# EAGLE schematic Player Module (EAGLE 9.3.0)
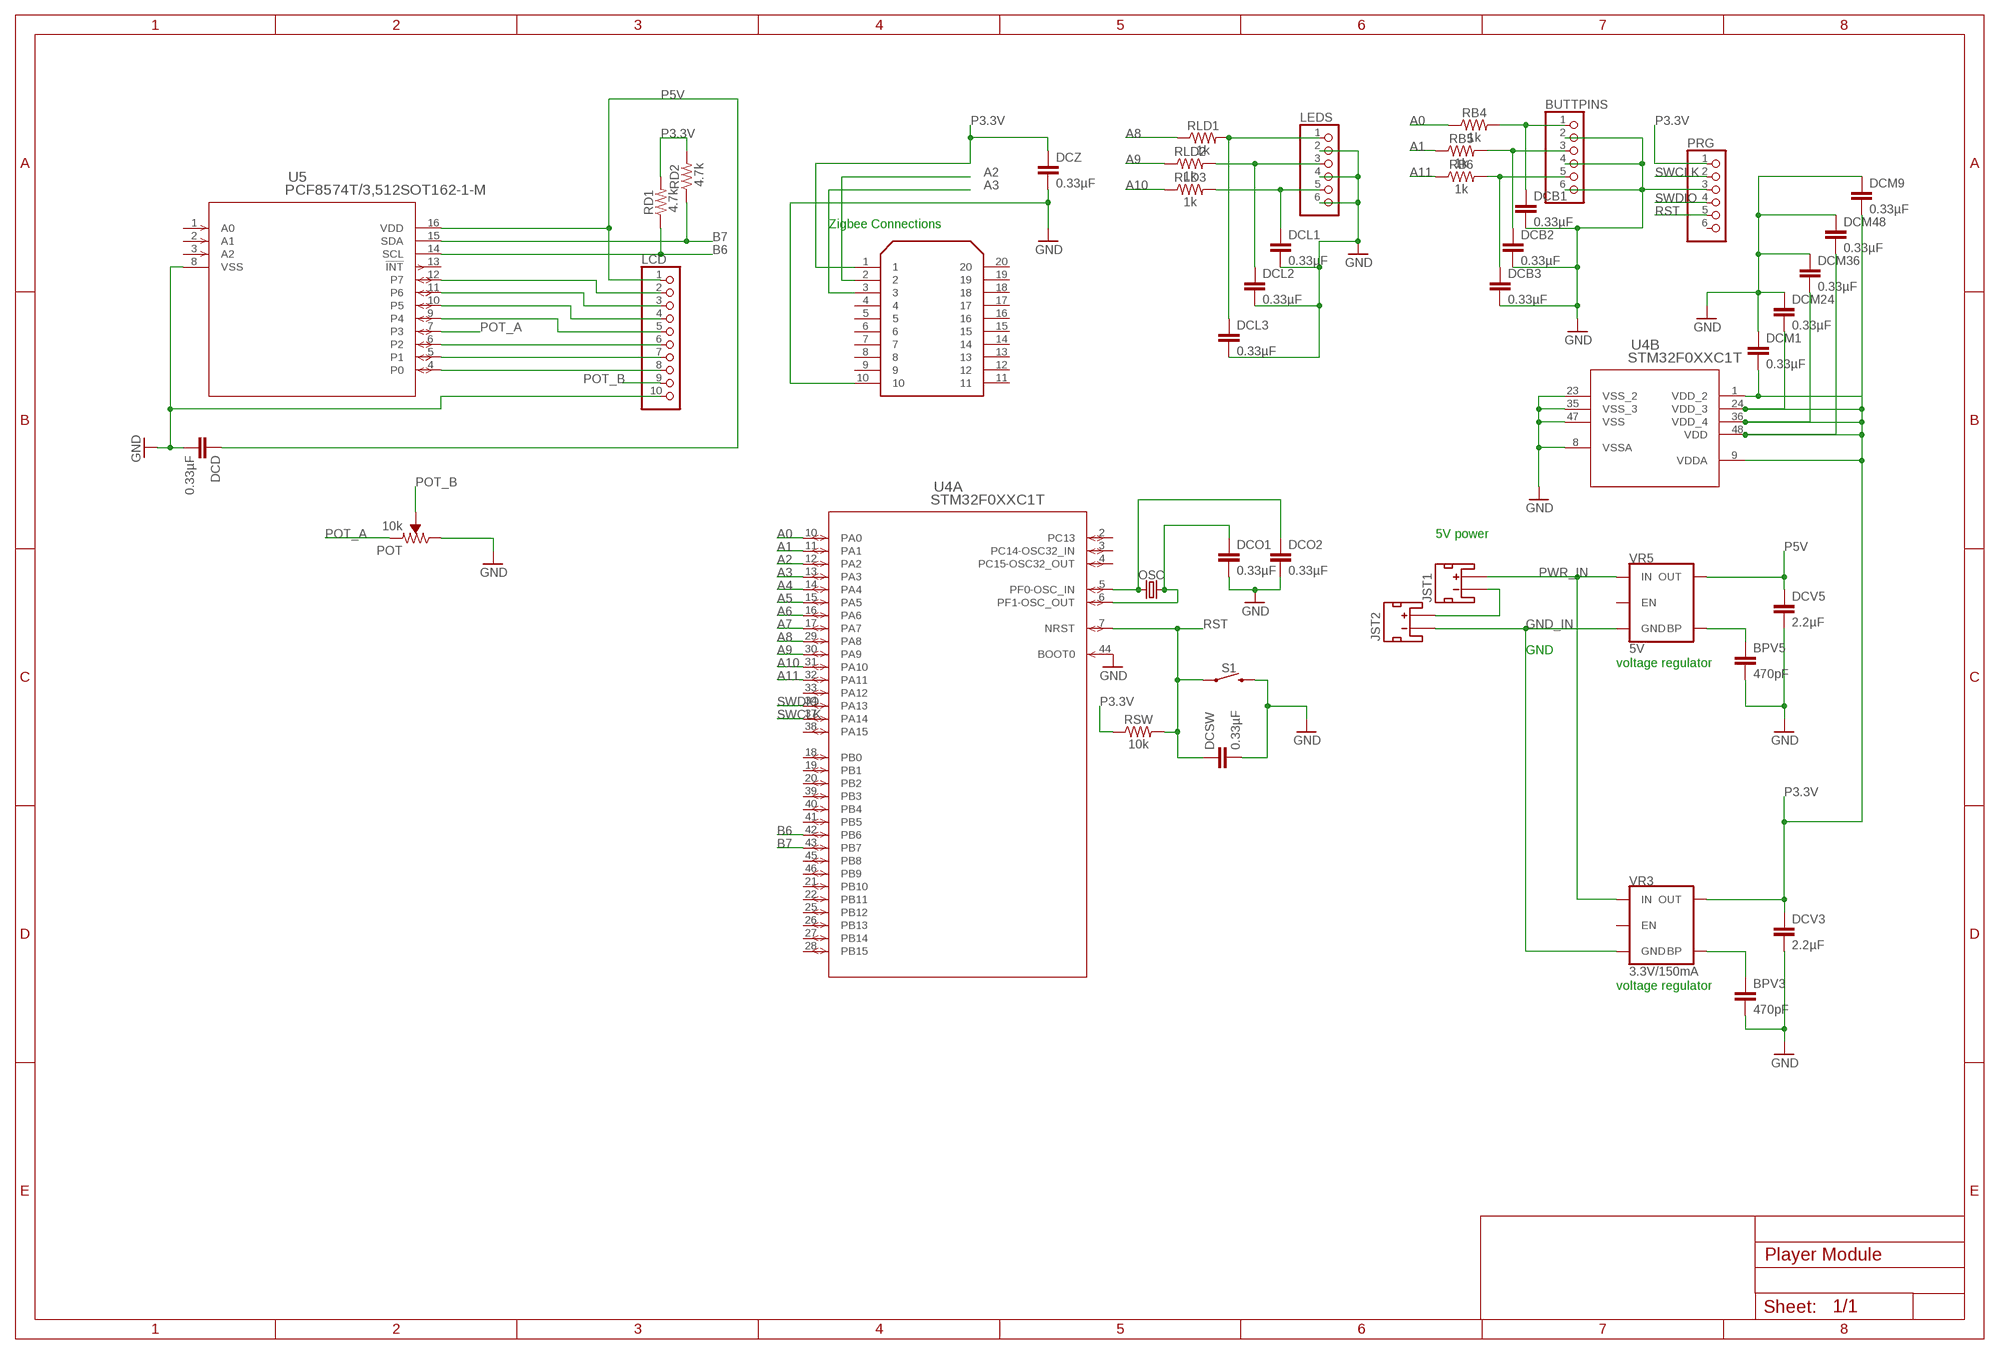
[diagram p0: schematic, sheet 1]

## Parts
BPV3  470pF  0.33UF/330NF-0805-50V-10%  [0805]
BPV5  470pF  0.33UF/330NF-0805-50V-10%  [0805]
BUTTPINS  PINHD-1X6  [1X06]
DCB1  0.33µF  0.33UF/330NF-0805-50V-10%  [0805]
DCB2  0.33µF  0.33UF/330NF-0805-50V-10%  [0805]
DCB3  0.33µF  0.33UF/330NF-0805-50V-10%  [0805]
DCD  0.33µF  0.33UF/330NF-0805-50V-10%  [0805]
DCL1  0.33µF  0.33UF/330NF-0805-50V-10%  [0805]
DCL2  0.33µF  0.33UF/330NF-0805-50V-10%  [0805]
DCL3  0.33µF  0.33UF/330NF-0805-50V-10%  [0805]
DCM1  0.33µF  0.33UF/330NF-0805-50V-10%  [0805]
DCM9  0.33µF  0.33UF/330NF-0805-50V-10%  [0805]
DCM24  0.33µF  0.33UF/330NF-0805-50V-10%  [0805]
DCM36  0.33µF  0.33UF/330NF-0805-50V-10%  [0805]
DCM48  0.33µF  0.33UF/330NF-0805-50V-10%  [0805]
DCO1  0.33µF  0.33UF/330NF-0805-50V-10%  [0805]
DCO2  0.33µF  0.33UF/330NF-0805-50V-10%  [0805]
DCSW  0.33µF  0.33UF/330NF-0805-50V-10%  [0805]
DCV3  2.2µF  0.33UF/330NF-0805-50V-10%  [0805]
DCV5  2.2µF  0.33UF/330NF-0805-50V-10%  [0805]
DCZ  0.33µF  0.33UF/330NF-0805-50V-10%  [0805]
JST1  JST_2MM_MALE  [JST-2-SMD]
JST2  JST_2MM_MALE  [JST-2-SMD]
LCD  PINHD-1X10  [1X10]
LEDS  PINHD-1X6  [1X06]
OSC  CRYSTALPTH-HC49US  [HC49US]
POT  10k  TRIMPOT-PTH-10MM-KNOB-1/2W-10%  [TRIMPOT-PTH-3386U]
PRG  PINHD-1X6  [1X06]
RB4  1k  RESISTOR0805  [0805]
RB5  1k  RESISTOR0805  [0805]
RB6  1k  RESISTOR0805  [0805]
RD1  4.7k  RESISTOR0805  [0805]
RD2  4.7k  RESISTOR0805  [0805]
RLD1  1k  RESISTOR0805  [0805]
RLD2  1k  RESISTOR0805  [0805]
RLD3  1k  RESISTOR0805  [0805]
RSW  10k  RESISTOR0805  [0805]
S1  MOMENTARY-SWITCH-SPST-SMD-5.2MM  [TACTILE_SWITCH_SMD_5.2MM]
U4  STM32F0XXC1T  [LQFP48-7X7MM]
U5  PCF8574T/3,512SOT162-1-M  [SOT162-1-M]
U$1  XB24-BPIT-004  [DIP-20]
VR3  3.3V/150mA  V_REG_MIC52053.3V  [SOT23-5]
VR5  5V  V_REG_MIC52055V  [SOT23-5]

## Nets
A0: RB4.1 U4.10(A:PA0)
A1: RB5.1 U4.11(A:PA1)
A2: U4.12(A:PA2) U$1.2
A3: U4.13(A:PA3) U$1.3
A4: U4.14(A:PA4)
A5: U4.15(A:PA5)
A6: U4.16(A:PA6)
A7: U4.17(A:PA7)
A8: RLD1.1 U4.29(A:PA8)
A9: RLD2.1 U4.30(A:PA9)
A10: RLD3.1 U4.31(A:PA10)
A11: RB6.1 U4.32(A:PA11)
B6: RD1.1 U4.42(A:PB6) U5.14(SCL)
B7: RD2.1 U4.43(A:PB7) U5.15(SDA)
GND: BPV3.2 BPV5.2 BUTTPINS.2 BUTTPINS.4 BUTTPINS.6 DCB1.2 DCB2.2 DCB3.2 DCD.2 DCL1.2 DCL2.2 DCL3.2 DCM1.1 DCM9.1 DCM24.1 DCM36.1 DCM48.1 DCO1.2 DCO2.2 DCSW.2 DCV3.2 DCV5.2 DCZ.2 LCD.10 LEDS.2 LEDS.4 LEDS.6 POT.3(CW) PRG.3 S1.3 U4.8(B:VSSA) U4.23(B:VSS_2) U4.35(B:VSS_3) U4.44(A:BOOT0) U4.47(B:VSS) U5.8(VSS) U$1.10
GND_IN: JST2.1(-) VR3.2(GND) VR5.2(GND)
N$1: JST1.1(-) JST2.2(+)
N$3: DCL3.1 LEDS.1 RLD1.2
N$4: DCL2.1 LEDS.3 RLD2.2
N$5: DCL1.1 LEDS.5 RLD3.2
N$8: BUTTPINS.1 DCB1.1 RB4.2
N$9: LCD.2 U5.12(P7)
N$10: LCD.3 U5.11(P6)
N$11: LCD.4 U5.10(P5)
N$12: LCD.5 U5.9(P4)
N$13: BUTTPINS.3 DCB2.1 RB5.2
N$14: LCD.6 U5.6(P2)
N$15: LCD.7 U5.5(P1)
N$16: LCD.8 U5.4(P0)
N$17: BUTTPINS.5 DCB3.1 RB6.2
N$21: DCO2.1 OSC.1 U4.5(A:PF0-OSC_IN)
N$22: DCO1.1 OSC.2 U4.6(A:PF1-OSC_OUT)
N$34: BPV3.1 VR3.4(BP)
N$37: BPV5.1 VR5.4(BP)
P3.3V: DCM1.2 DCM9.2 DCM24.2 DCM36.2 DCM48.2 DCV3.1 DCZ.1 PRG.1 RD1.2 RD2.2 RSW.1 U4.1(B:VDD_2) U4.9(B:VDDA) U4.24(B:VDD_3) U4.36(B:VDD_4) U4.48(B:VDD) U$1.1 VR3.5(OUT)
P5V: DCD.1 DCV5.1 LCD.1 U5.16(VDD) VR5.5(OUT)
POT_A: POT.1(CCW) U5.7(P3)
POT_B: LCD.9 POT.2(WIPER)
PWR_IN: JST1.2(+) VR3.1(IN) VR5.1(IN)
RST: DCSW.1 PRG.5 RSW.2 S1.1 U4.7(A:NRST)
SWCLK: PRG.2 U4.37(A:PA14)
SWDIO: PRG.4 U4.34(A:PA13)
Unconnected: JST1.NC1(PAD1) JST1.NC2(PAD2) JST2.NC1(PAD1) JST2.NC2(PAD2) PRG.6 U4.2(A:PC13) U4.3(A:PC14-OSC32_IN) U4.4(A:PC15-OSC32_OUT) U4.18(A:PB0) U4.19(A:PB1) U4.20(A:PB2) U4.21(A:PB10) U4.22(A:PB11) U4.25(A:PB12) U4.26(A:PB13) U4.27(A:PB14) U4.28(A:PB15) U4.33(A:PA12) U4.38(A:PA15) U4.39(A:PB3) U4.40(A:PB4) U4.41(A:PB5) U4.45(A:PB8) U4.46(A:PB9) U5.1(A0) U5.2(A1) U5.3(A2) U5.13(!INT) U$1.4 U$1.5 U$1.6 U$1.7 U$1.8 U$1.9 U$1.11 U$1.12 U$1.13 U$1.14 U$1.15 U$1.16 U$1.17 U$1.18 U$1.19 U$1.20 VR3.3(EN) VR5.3(EN)

## Notes on the sheet
- Zigbee Connections
- 5V power
- GND
- voltage regulator
- voltage regulator

## Library data of the parts
BPV3 BPV5 DCV3 DCV5 = SparkFun-Capacitors:0.33UF/330NF: 0.33µF/330nF ceramic capacitors A capacitor is a passive two-terminal electrical component used to store electrical energy temporarily in an electric field.; PROD_ID: CAP-08469; VALUE: 0.33µF
BUTTPINS LEDS PRG = pinhead:PINHD-1X6: PIN HEADER
DCB1-DCB3 DCD DCL1-DCL3 DCM1 DCM9 DCM24 DCM36 DCM48 DCO1 DCO2 DCSW DCZ = SparkFun-Capacitors:0.33UF/330NF: 0.33µF/330nF ceramic capacitors A capacitor is a passive two-terminal electrical component used to store electrical energy temporarily in an electric field.; PROD_ID: CAP-08469
JST1 JST2 = SparkFun-Connectors:JST_2MM_MALE: JST 2MM MALE RA CONNECTOR Two pin, compact surface mount connector. Commonly used as a battery input connection point. We really like the solid locking feeling and high current rating on these small connectors. We use these all the time as battery connectors. Mates to single-cell LiPo batteries. Here is the connector we sell at SparkFun: JST Right Angle Connector - White <https://www.sparkfun.com/products/8612> (PRT-08612) Datasheet <http://www.sparkfun.com/datasheets/Prototyping/Connectors/JST-Horizontal.pdf> It was used on these SparkFun products: SparkFun MOSFET Power Controller <https://www.sparkfun.com/products/11214> (PRT-11214) SparkFun Battery Babysitter - LiPo Battery Manager <https://www.sparkfun.com/products/13777> (PRT-13777) And many, many others that required a lipo battery connection.; PROD_ID: CONN-11443; SF_ID: PRT-08612
LCD = pinhead:PINHD-1X10: PIN HEADER
OSC = SparkFun-Clocks:CRYSTAL: Crystals (Generic) These are passive quartz crystals, which can be used as a clock source for a microcontroller. Crystal's are two-terminal devices. They require external "load" capacitors to generate an oscillating signal.
POT = SparkFun-Resistors:TRIMPOT: Trimming Potentiometer (Trimpot) Three-terminal potentiometers, with an adjustable wiper and two adjustable resistors. A pot can be used to create a configurable voltage divider, or as a variable resistor. "Trimpots" are a subset of potentiometers, usually intended for "set-and-forget" applications. They're often more delicate than standard potentiometers - rated for fewer turns. Variants PTH-KNOB - PTH Trimpot w/ finger-adjustable knob Trimpot 10K with Knob <https://www.sparkfun.com/products/9806> (COM-09806) Datasheet <http://www.sparkfun.com/datasheets/Components/General/TSR-3386.pdf> SMD-3MM-CLOSED-FRAME - SMD 3mm Square Closed-Frame Trimpot Used on e.g. EasyDriver - Stepper Motor Driver <https://www.sparkfun.com/products/12779> Datasheet <http://www.bitechnologies.com/pdfs/22.pdf> (22AR10KTR) SMD-5MM - SMD 5mm Square Closed-Frame Trimpot Used on e.g. IOIO-OTG - V2.2 <https://www.sparkfun.com/products/13613> Datasheet <http://www.vishay.com/docs/51008/ts53.pdf> (TS53YL502MR10) SMD-3MM-1/10W-25% - 3mm Square Open-Frame Trimpot Used on e.g. SparkFun Shapeoko <https://www.sparkfun.com/products/13899> Datasheet <http://www.bourns.com/docs/Product-Datasheets/TC33.pdf> (TC33X-2-103E); PROD_ID: RES-09730; SF_SKU: COM-09806
RB4-RB6 RD1 RD2 RLD1-RLD3 RSW = SparkFun-Resistors:RESISTOR: Generic Resistor Package
S1 = SparkFun-Switches:MOMENTARY-SWITCH-SPST: Momentary Switch (Pushbutton) - SPST Normally-open (NO) SPST momentary switches (buttons, pushbuttons). Variants PTH-12MM - 12mm square, through-hole Momentary Pushbutton Switch - 12mm Square <https://www.sparkfun.com/products/9190> (COM-09190) PTH-6.0MM, PTH-6.0MM-KIT - 6.0mm square, through-hole Mini Pushbutton Switch <https://www.sparkfun.com/products/97> (COM-00097) KIT package intended for soldering kit's - only one side of pads' copper is exposed. PTH-RIGHT-ANGLE-KIT - Right-angle, through-hole Right Angle Tactile Button <https://www.sparkfun.com/products/10791> - Used on SparkFun BigTime Watch Kit <https://www.sparkfun.com/products/11734> SMD-12MM - 12mm square, surface-mount Tactile Button - SMD (12mm) <https://www.sparkfun.com/products/12993> (COM-12993) Used on SparkFun PicoBoard <https://www.sparkfun.com/products/11888> SMD-4.5MM - 4.5mm Square Trackball Switch Used on SparkFun Blackberry Trackballer Breakout <https://www.sparkfun.com/products/13169> SMD-4.6MMX2.8MM - 4.60mm x 2.80mm, surface mount Used on SparkFun SAMD21 Mini Breakout <https://www.sparkfun.com/products/13664> SMD-5.2MM, SMD-5.2-REDUNDANT - 5.2mm square, surface-mount Mini Pushbutton Switch - SMD <https://www.sparkfun.com/products/8720> (COM-08720) Used on Arduino Pro Mini <https://www.sparkfun.com/products/11114> REDUNDANT package connects both switch circuits together SMD-6.0X3.5MM - 6.0 x 3.5mm, surface mount Momentary Reset Switch SMD <https://www.sparkfun.com/products/8229> (COM-08229) SMD-6.2MM-TALL - 6.2mm square, surface mount Tactile Button - SMD (6mm) <https://www.sparkfun.com/products/12992> Used on SparkFun Digital Sandbox <https://www.sparkfun.com/products/12651> SMD-RIGHT-ANGLE - Right-angle, surface mount Used on SparkFun Block for Intel® Edison - Arduino <https://www.sparkfun.com/products/13036>; PROD_ID: SWCH-08247; SF_SKU: COM-08720
U4 = ECE477_Resources:STM32F0XXC1T; MANUFACTURER_PART_NUMBER: stm32f0xxc1t; VENDOR: STMicroelectronics
U5 = ECE477_Resources:PCF8574T/3,512; MANUFACTURER_PART_NUMBER: PCF8574T3512; VENDOR: NXP
U$1 = XB24-BPIT-004:XB24-BPIT-004: Xbee Zb (Zigbee Pro Feature Set), 1mw, Wire Antenna, 250000; AVAILABILITY: Unavailable; DESCRIPTION: Xbee Znet 2.5 _Series 2_, 1mw, Pcb Antenna, 250000 Bps, Rout; MF: Digi International; MP: XB24-BPIT-004; PACKAGE: Module Digi International; PRICE: None
VR3 = SparkFun-IC-Power:V_REG_MIC5205: V_REG MIC5205 Standard 3.3V, 5V, and Adjustable 150mA LDO voltage regulator in SOT-23 layout. Micrel part MIC5205. BP (by-pass) pin is used to lower output noise with 470pF cap, may be left open. On the adjustable version BP is used to set output.; PROD_ID: VREG-00822
VR5 = SparkFun-IC-Power:V_REG_MIC5205: V_REG MIC5205 Standard 3.3V, 5V, and Adjustable 150mA LDO voltage regulator in SOT-23 layout. Micrel part MIC5205. BP (by-pass) pin is used to lower output noise with 470pF cap, may be left open. On the adjustable version BP is used to set output.; PROD_ID: VREG-00823